# Altium schematic sheet 07.SchDoc
size 297 x 209 mm
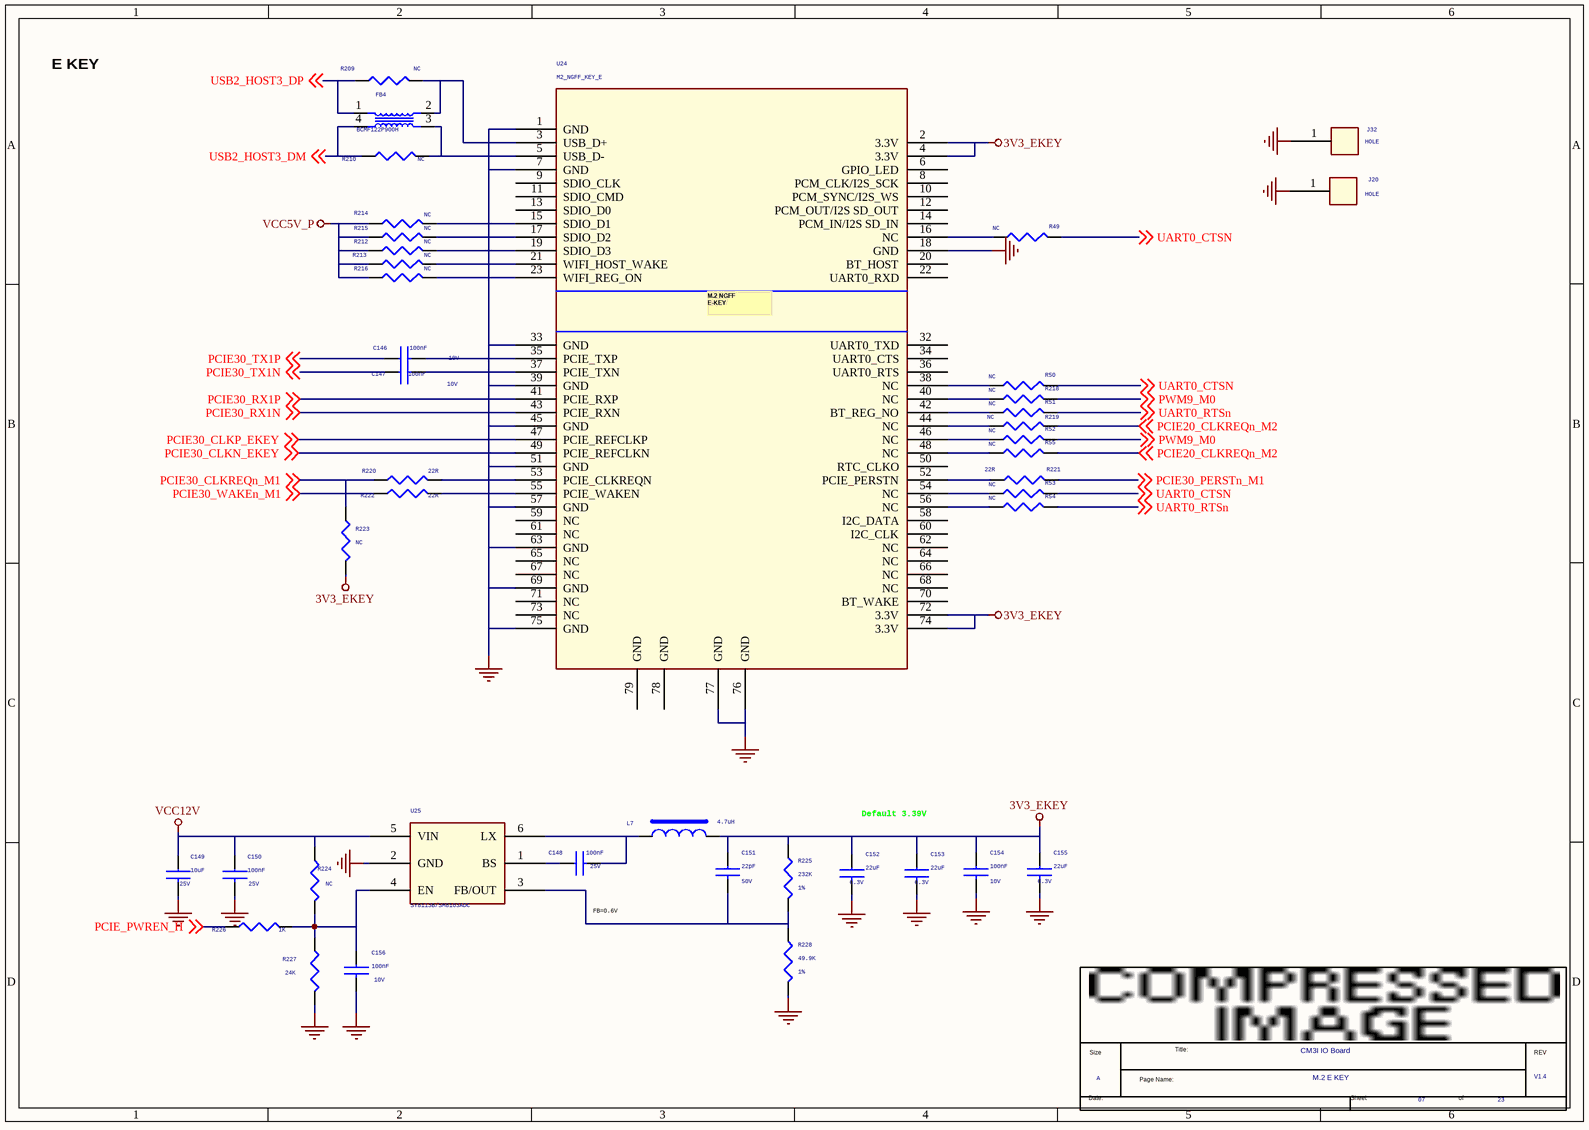
[diagram p0: 07.SchDoc]

## Parts
*  Page Count: 23  Page Number: 07  Page Size: A  Title: CM3I IO Board  RevCode: V1.4  Doc: M.2 E KEY  (hidden comment: radxa_1010)  (graphical)
C146  100nF  Voltage: 10V  [C0402]
C147  100nF  Voltage: 10V  [C0402]
C148  100nF  Voltage: 25V  [C0402]
C149  10uF  Voltage: 25V  [C0805]
C150  100nF  Voltage: 25V  [C0402]
C151  22pF  Voltage: 50V  [C0402]
C152  22uF  Voltage: 6.3V  [C0603]
C153  22uF  Voltage: 6.3V  [C0603]
C154  100nF  Voltage: 10V  [C0402]
C155  22uF  Voltage: 6.3V  [C0603]
C156  100nF  Voltage: 10V  [C0402]
FB4  BCMF122P900H  [GMDG-4PIN_ESD]
J20  HOLE  [HOLE_5D5X2D7MM]
J32  HOLE  [HOLE_5D5X2D7MM]
L7  4.7uH  [IND-4X4]
R49  NC  [R0402]
R50  NC  [R0402]
R51  NC  [R0402]
R52  NC  [R0402]
R53  NC  [R0402]
R54  NC  [R0402]
R55  NC  [R0402]
R209  NC  [R0402]
R210  NC  [R0402]
R212  NC  [R0402]
R213  NC  [R0402]
R214  NC  [R0402]
R215  NC  [R0402]
R216  NC  [R0402]
R218  NC  [R0402]
R219  NC  [R0402]
R220  22R  [R0402]
R221  22R  [R0402]
R222  22R  [R0402]
R223  NC  [R0402]
R224  NC  [R0402]
R225  232K  Tolerance: 1%  [R0402]
R226  1K  [R0402]
R227  24K  [R0402]
R228  49.9K  Tolerance: 1%  [R0402]
U24  M2_NGFF_KEY_E  [M2_NGFF_KEY_E_42X30]
U25  SY8113B/SM8103ADC  [SOT_23_6]

## Nets
3V3_EKEY: C151.1 C152.1 C153.1 C154.1 C155.1 L7.2 R223.2 R225.1 U24.2(3.3V) U24.4(3.3V) U24.72(3.3V) U24.74(3.3V)
GND: C149.2 C150.2 C152.2 C153.2 C154.2 C155.2 C156.2 J20.1 J32.1 R227.2 R228.2 U24.1(GND) U24.7(GND) U24.18(GND) U24.33(GND) U24.39(GND) U24.45(GND) U24.51(GND) U24.57(GND) U24.63(GND) U24.69(GND) U24.75(GND) U24.76(GND) U24.77(GND) U25.2(GND)
VCC5V_P: R212.1 R213.1 R214.1 R215.1 R216.1
VCC12V: C149.1 C150.1 R224.1 U25.5(VIN)
PCIE20_CLKREQn_M2: R55.1 R219.1 ; off-sheet PCIE20_CLKREQn_M2
PCIE30_CLKN_EKEY: U24.49(PCIE_REFCLKN) ; off-sheet PCIE30_CLKN_EKEY
PCIE30_CLKP_EKEY: U24.47(PCIE_REFCLKP) ; off-sheet PCIE30_CLKP_EKEY
PCIE30_CLKREQn_M1: R220.1 R223.1 ; off-sheet PCIE30_CLKREQn_M1
PCIE30_PERSTn_M1: R221.1 ; off-sheet PCIE30_PERSTn_M1
PCIE30_RX1N: U24.43(PCIE_RXN) ; off-sheet PCIE30_RX1N
PCIE30_RX1P: U24.41(PCIE_RXP) ; off-sheet PCIE30_RX1P
PCIE30_TX1N: C147.1 ; off-sheet PCIE30_TX1N
PCIE30_TX1P: C146.1 ; off-sheet PCIE30_TX1P
PCIE30_WAKEn_M1: R222.1 ; off-sheet PCIE30_WAKEn_M1
PCIE_PWREN_H: R226.1 ; off-sheet PCIE_PWREN_H
PWM9_M0: R52.1 R218.1 ; off-sheet PWM9_M0
UART0_CTSN: R49.1 R50.1 R53.1 ; off-sheet UART0_CTSN
UART0_RTSn: R51.1 R54.1 ; off-sheet UART0_RTSn
USB2_HOST3_DM: FB4.4(R2) R210.1 ; off-sheet USB2_HOST3_DM
USB2_HOST3_DP: FB4.1(R1) R209.1 ; off-sheet USB2_HOST3_DP
NetC146_2: C146.2 U24.35(PCIE_TXP)
NetC147_2: C147.2 U24.37(PCIE_TXN)
NetC148_1: C148.1 U25.1(BS)
NetC148_2: C148.2 L7.1 U25.6(LX)
NetC151_2: C151.2 R225.2 R228.1 U25.3(FB/OUT)
NetC156_1: C156.1 R224.2 R226.2 R227.1 U25.4(EN)
NetFB4_2: FB4.2(R4) R209.2 U24.3(USB_D+)
NetFB4_3: FB4.3(R3) R210.2 U24.5(USB_D-)
NetR49_2: R49.2 U24.16(NC)
NetR50_2: R50.2 U24.38(NC)
NetR51_2: R51.2 U24.42(BT_REG_NO)
NetR52_2: R52.2 U24.46(NC)
NetR53_2: R53.2 U24.54(NC)
NetR54_2: R54.2 U24.56(NC)
NetR55_2: R55.2 U24.48(NC)
NetR212_2: R212.2 U24.19(SDIO_D3)
NetR213_2: R213.2 U24.21(WIFI_HOST_WAKE)
NetR214_2: R214.2 U24.15(SDIO_D1)
NetR215_2: R215.2 U24.17(SDIO_D2)
NetR216_2: R216.2 U24.23(WIFI_REG_ON)
NetR218_2: R218.2 U24.40(NC)
NetR219_2: R219.2 U24.44(NC)
NetR220_2: R220.2 U24.53(PCIE_CLKREQN)
NetR221_2: R221.2 U24.52(PCIE_PERSTN)
NetR222_2: R222.2 U24.55(PCIE_WAKEN)

Not connected (* = marked no-connect by the designer): U24 6(GPIO_LED) 8(PCM_CLK/I2S_SCK) 9(SDIO_CLK) 10(PCM_SYNC/I2S_WS) 11(SDIO_CMD) 12(PCM_OUT/I2S_SD_OUT) 13(SDIO_D0) 14(PCM_IN/I2S_SD_IN) 20(BT_HOST) 22(UART0_RXD) 32(UART0_TXD) 34(UART0_CTS) 36(UART0_RTS) 50(RTC_CLKO) 58(I2C_DATA) 59(NC) 60(I2C_CLK) 61(NC) 62(NC) 64(NC) 65(NC) 66(NC) 67(NC) 68(NC) 70(BT_WAKE) 71(NC) 73(NC) 78(GND) 79(GND)

## Notes on the sheet
- E KEY
- Default 3.39V
- (near C148) FB=0.6V
- (in symbol M_8.2 NGFF EKEY SOCKET) M.2 NGFF / E-KEY
- (in symbol radxa_1010) Title:; Size; REV; Page Name:; Date:; Sheet; of

## Library data of the parts
C146 = CAP NP_0: cap,100.00nF,+/-10%,10V,X5R,C0201; Manufacturer PN: C0603X5R1A104K030BC; Manufacturer: TDK; Tolerance: 10%; Priority: A; Dielectric: X5R; Created by: JJJ; Part Type: C0201; RK PN: C0603X5R1A104K030BC
C147 = CAP NP_0: cap,100.00nF,+/-10%,10V,X5R,C0201; Manufacturer: TDK; RK PN: C0603X5R1A104K030BC; Priority: A; Tolerance: 10%; Dielectric: X5R; Part Type: C0201; Manufacturer PN: C0603X5R1A104K030BC; Created by: JJJ
C148 = CAP NP_0: cap,100.00nF,+/-10%,25V,X5R,C0402; Manufacturer PN: C1005X5R1E104K050BC; Manufacturer: TDK; C_Voltage: 6.3V; Tolerance: 10%; Priority: A; Number: 37; Dielectric: X5R; Created by: JJJ; Part Type: C0402; RK PN: C1005X5R1E104K050BC
C149 = CAP NP_0: cap,10.00uF,+/-10%,25V,X5R,C1206; Manufacturer: TDK; RK PN: C3216X5R1E106K085AC; Priority: A; C_Voltage: 6.3V; Tolerance: 10%; Dielectric: X5R; Part Type: C1206; Manufacturer PN: C3216X5R1E106K085AC; Created by: JJJ
C150 = CAP NP_0: cap,100.00nF,+/-10%,25V,X5R,C0402; Manufacturer PN: C1005X5R1E104K050BC; Manufacturer: TDK; Tolerance: 10%; Priority: A; Dielectric: X5R; Created by: JJJ; Part Type: C0402; RK PN: C1005X5R1E104K050BC
C151 = CAP NP_0: cap,22.00pF,+/-5%,50V,C0G,C0402; Manufacturer: TDK; RK PN: C1005C0G1H220J050BA; Priority: A; Tolerance: 5%; Dielectric: C0G; Part Type: C0402; Manufacturer PN: C1005C0G1H220J050BA; Created by: JJJ
C152 C155 = CAP NP_0: cap,22.00uF,+/-10%,10V,X5R,C0805; Manufacturer: TDK; RK PN: C2012X5R1A226K125AB; Priority: A; Tolerance: 10%; Dielectric: X5R; Part Type: C0805; C_Voltage: 6.3V; Manufacturer PN: C2012X5R1A226K125AB; Created by: JJJ
C153 = CAP NP_0: cap,22.00uF,+/-10%,10V,X5R,C0805; Manufacturer PN: C2012X5R1A226K125AB; Manufacturer: TDK; Tolerance: 10%; Priority: A; Dielectric: X5R; Created by: JJJ; C_Voltage: 6.3V; Part Type: C0805; RK PN: C2012X5R1A226K125AB
C154 C156 = CAP NP_0: cap,100.00nF,+/-10%,10V,X5R,C0402; Manufacturer: TDK; Number: 37; RK PN: C1005X5R1A104K050BA; Priority: A; Tolerance: 10%; C_Voltage: 6.3V; Dielectric: X5R; Part Type: C0402; Manufacturer PN: C1005X5R1A104K050BA; Created by: JJJ
FB4 = R-PACK4_1_Dup1
J20 J32 = CON1
L7 = INDUCTORS OF FERRITE_Dup1: Power Inductor,4.7uH,0.2,IND_606045; Manufacturer: sunlord; DC Resistor: 0.02ohm; Isat: 4.97A; RK PN: SWPA6045S4R7MT; Priority: A; Tolerance: 20%; Irms: 3.3A; Resonace frequency: 24M; Part Type: POWER_IND; Manufacturer PN: SWPA6045S4R7MT; Created by: YWQ
R49 R212 R215 R216 R219 R221 = RESISTOR_0_Dup1: 通用厚膜电阻,22R,+/-5%,R0402,1/16W.; Manufacturer: YAGEO; Tolerance: 5%; RK PN: RC0402JR-0722RL; Priority: A; Wattage: 1/16W; Part Type: 通用厚膜电阻; Manufacturer PN: RC0402JR-0722RL; Created by: YTL
R50-R55 R209 R210 R213 R214 R218 R220 R222 = RESISTOR_0_Dup1: 通用厚膜电阻,22R,+/-5%,R0402,1/16W.; Manufacturer PN: RC0402JR-0722RL; Manufacturer: YAGEO; Tolerance: 5%; Wattage: 1/16W; Priority: A; Created by: YTL; Part Type: 通用厚膜电阻; RK PN: RC0402JR-0722RL
R223 = RESISTOR_0_Dup1: 通用厚膜电阻,10K,+/-5%,R0402,1/16W.; Manufacturer PN: RC0402JR-0710KL; Manufacturer: YAGEO; Tolerance: 5%; Wattage: 1/16W; Priority: A; Created by: YTL; Part Type: 通用厚膜电阻; RK PN: RC0402JR-0710KL
R224 R227 = RESISTOR_0_Dup1: 通用厚膜电阻,24K,+/-5%,R0402,1/16W.; Manufacturer PN: RC0402JR-0724KL; Manufacturer: YAGEO; Tolerance: 5%; Wattage: 1/16W; Priority: A; Created by: YTL; Part Type: 通用厚膜电阻; RK PN: RC0402JR-0724KL
R225 = RESISTOR_0_Dup1: 通用厚膜电阻,232K,+/-1%,R0402,1/16W.; Manufacturer: YAGEO; RK PN: RC0402FR-07232KL; Priority: A; Wattage: 1/16W; Part Type: 通用厚膜电阻; Manufacturer PN: RC0402FR-07232KL; Created by: YTL
R226 = RESISTOR_0_Dup1: 通用厚膜电阻,100K,+/-5%,R0402,1/16W.; Manufacturer PN: RC0402JR-07100KL; Manufacturer: YAGEO; Tolerance: 5%; Wattage: 1/16W; Priority: A; Created by: YTL; Part Type: 通用厚膜电阻; RK PN: RC0402JR-07100KL
R228 = RESISTOR_0_Dup1: 通用厚膜电阻,49K9,+/-1%,R0402,1/16W.; Manufacturer PN: RC0402FR-0749K9L; Manufacturer: YAGEO; Wattage: 1/16W; Priority: A; Created by: YTL; Part Type: 通用厚膜电阻; RK PN: RC0402FR-0749K9L
U24 = M_8.2 NGFF EKEY SOCKET
U25 = DCDC_SY8113: Manufacturer: Silergy（矽力杰）; Priority: A; Created by: JJJ; Manufacturer PN: SY8113B; Part Type: DCDC; RK PN: SY8113B
* = radxa_1010: Page Create Date: March  8, 1995